# EAGLE design icE1usb-proto (EAGLE 7.5.0)

## Sheet 1 of 2: E1 Line interface
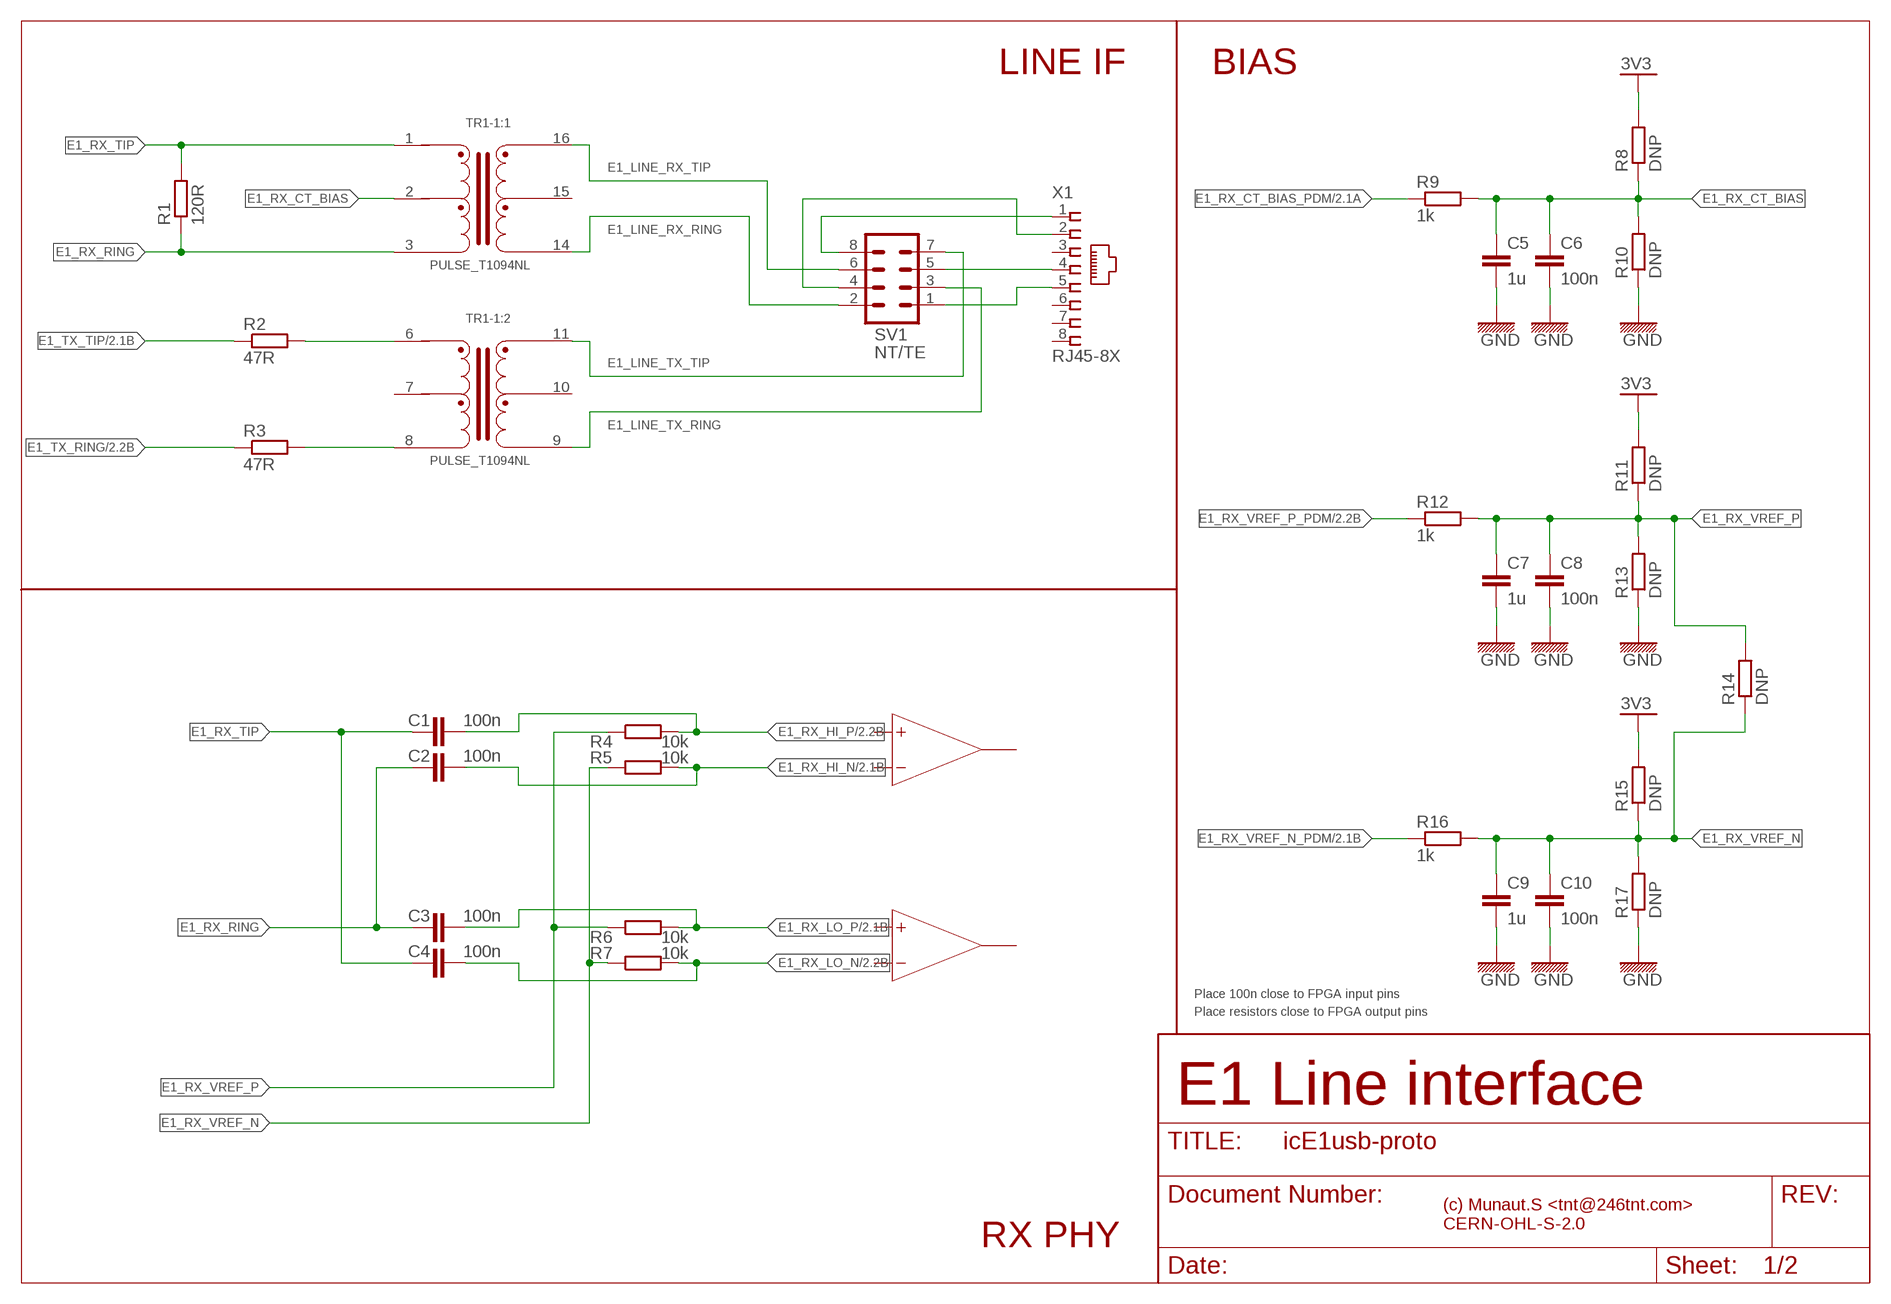
[diagram p0: schematic, sheet 1]

### Parts
C1  100n  C-EU_0603  [0603]
C2  100n  C-EU_0603  [0603]
C3  100n  C-EU_0603  [0603]
C4  100n  C-EU_0603  [0603]
C5  1u  C-EU_0603  [0603]
C6  100n  C-EU_0603  [0603]
C7  1u  C-EU_0603  [0603]
C8  100n  C-EU_0603  [0603]
C9  1u  C-EU_0603  [0603]
C10  100n  C-EU_0603  [0603]
R1  120R  R-EU_0603_A  [0603_A]
R2  47R  R-EU_0603_A  [0603_A]
R3  47R  R-EU_0603_A  [0603_A]
R4  10k  R-EU_0603_A  [0603_A]
R5  10k  R-EU_0603_A  [0603_A]
R6  10k  R-EU_0603_A  [0603_A]
R7  10k  R-EU_0603_A  [0603_A]
R8  DNP  R-EU_0603_A  [0603_A]
R9  1k  R-EU_0603_A  [0603_A]
R10  DNP  R-EU_0603_A  [0603_A]
R11  DNP  R-EU_0603_A  [0603_A]
R12  1k  R-EU_0603_A  [0603_A]
R13  DNP  R-EU_0603_A  [0603_A]
R14  DNP  R-EU_0603_A  [0603_A]
R15  DNP  R-EU_0603_A  [0603_A]
R16  1k  R-EU_0603_A  [0603_A]
R17  DNP  R-EU_0603_A  [0603_A]
SV1  NT/TE  MA04-2  [MA04-2]
TR1  PULSE_T1094NL  [PULSE_BH]
X1  RJ45-8X  [RJ45-NO-SHIELD]

### Nets
3V3: R8.2 R11.2 R15.2 ; also sheet 2
E1_LINE_P1: SV1.8 X1.1
E1_LINE_P2: SV1.4 X1.2
E1_LINE_P4: SV1.5 X1.4
E1_LINE_P5: SV1.1 X1.5
E1_LINE_RX_RING: SV1.2 TR1.14
E1_LINE_RX_TIP: SV1.6 TR1.16
E1_LINE_TX_RING: SV1.3 TR1.9
E1_LINE_TX_TIP: SV1.7 TR1.11
E1_RX_CT_BIAS: C5.1 C6.1 R8.1 R9.2 R10.2 TR1.2
E1_RX_CT_BIAS_PDM: R9.1 ; also sheet 2
E1_RX_HI_N: C2.2 R5.2 ; also sheet 2
E1_RX_HI_P: C1.2 R4.2 ; also sheet 2
E1_RX_LO_N: C4.2 R7.2 ; also sheet 2
E1_RX_LO_P: C3.2 R6.2 ; also sheet 2
E1_RX_RING: C2.1 C3.1 R1.1 TR1.3
E1_RX_TIP: C1.1 C4.1 R1.2 TR1.1
E1_RX_VREF_N: C9.1 C10.1 R5.1 R7.1 R14.1 R15.1 R16.2 R17.2
E1_RX_VREF_N_PDM: R16.1 ; also sheet 2
E1_RX_VREF_P: C7.1 C8.1 R4.1 R6.1 R11.1 R12.2 R13.2 R14.2
E1_RX_VREF_P_PDM: R12.1 ; also sheet 2
E1_TX_RING: R3.1 ; also sheet 2
E1_TX_TIP: R2.1 ; also sheet 2
GND: C5.2 C6.2 C7.2 C8.2 C9.2 C10.2 R10.1 R13.1 R17.1 ; also sheet 2
N$2: R2.2 TR1.6
N$3: R3.2 TR1.8
Unconnected: TR1.7 TR1.10 TR1.15 X1.3 X1.6 X1.7 X1.8

### Notes on the sheet
- LINE IF | BIAS
- Place 100n close to FPGA input pins
- Place resistors close to FPGA output pins
- E1 Line interface
- (c) Munaut.S <tnt@246tnt.com>
  CERN-OHL-S-2.0
- RX PHY

## Sheet 2 of 2: PMOD, USB & Clock
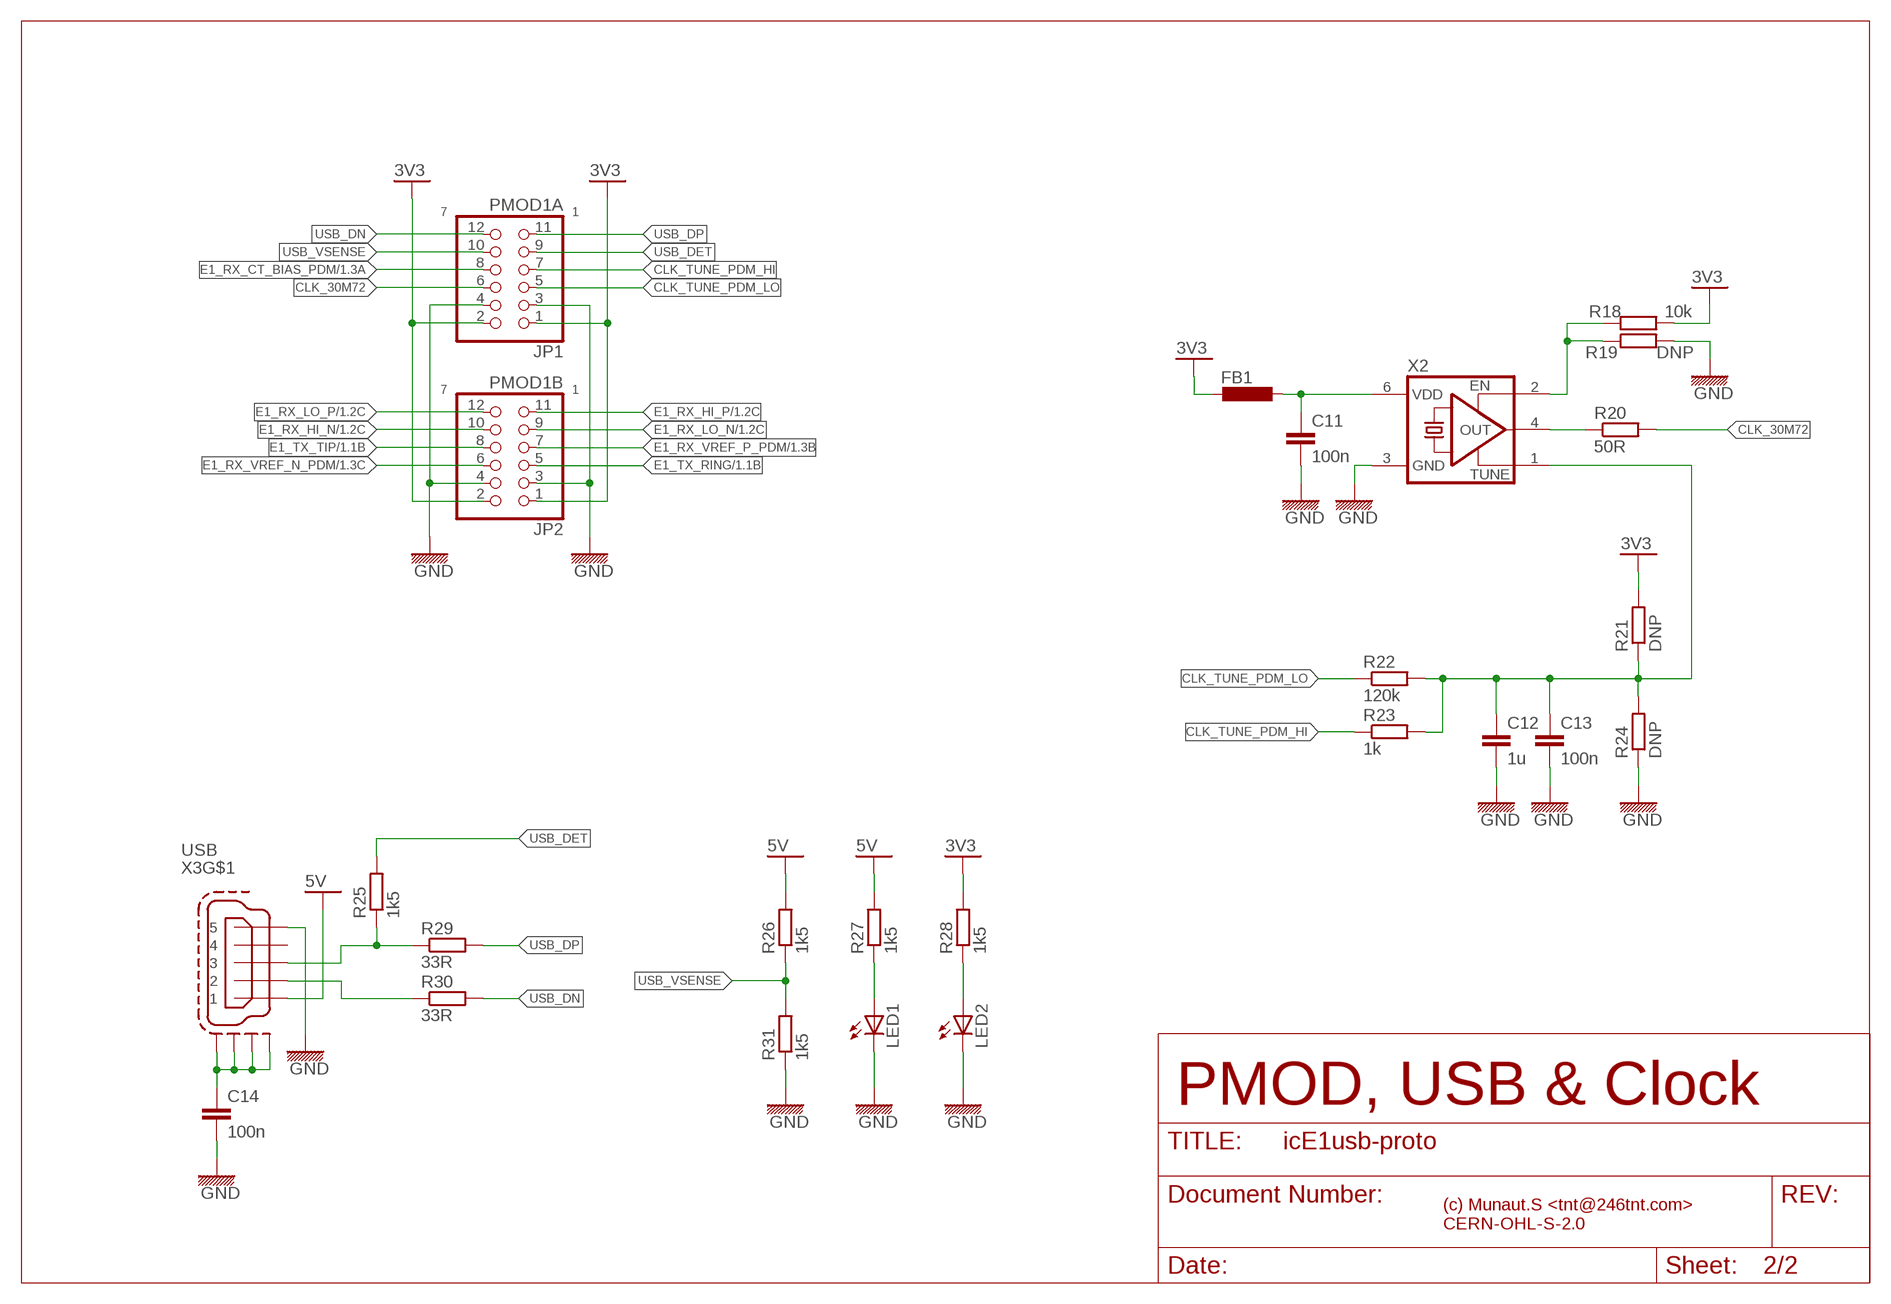
[diagram p1: schematic, sheet 2]

### Parts
C11  100n  C-EU_0603  [0603]
C12  1u  C-EU_0603  [0603]
C13  100n  C-EU_0603  [0603]
C14  100n  C-EU_0603  [0603]
FB1  FBEAD_0603  [0603]
JP1  PMOD1A  PINHD-2X6/90  [2X06/90]
JP2  PMOD1B  PINHD-2X6/90  [2X06/90]
LED1  LEDCHIPLED_0603  [CHIPLED_0603]
LED2  LEDCHIPLED_0603  [CHIPLED_0603]
R18  10k  R-EU_0603_A  [0603_A]
R19  DNP  R-EU_0603_A  [0603_A]
R20  50R  R-EU_0603_A  [0603_A]
R21  DNP  R-EU_0603_A  [0603_A]
R22  120k  R-EU_0603_A  [0603_A]
R23  1k  R-EU_0603_A  [0603_A]
R24  DNP  R-EU_0603_A  [0603_A]
R25  1k5  R-EU_0603_A  [0603_A]
R26  1k5  R-EU_0603_A  [0603_A]
R27  1k5  R-EU_0603_A  [0603_A]
R28  1k5  R-EU_0603_A  [0603_A]
R29  33R  R-EU_0603_A  [0603_A]
R30  33R  R-EU_0603_A  [0603_A]
R31  1k5  R-EU_0603_A  [0603_A]
X2  XTAL_OSC_ET_CFPV-45/46  [CFPV-45/46]
X3  USB  MINI-USB-SCHIELD-32005-201  [32005-201]

### Nets
3V3: FB1.1 JP1.1 JP1.2 JP2.1 JP2.2 R18.2 R21.2 R28.2 ; also sheet 1
5V: R26.2 R27.2 X3.1
CLK_30M72: JP1.6 R20.2
CLK_30M72_RAW: R20.1 X2.4(OUT)
CLK_TUNE: C12.1 C13.1 R21.1 R22.2 R23.2 R24.2 X2.1(TUNE)
CLK_TUNE_PDM_HI: JP1.7 R23.1
CLK_TUNE_PDM_LO: JP1.5 R22.1
E1_RX_CT_BIAS_PDM: JP1.8 ; also sheet 1
E1_RX_HI_N: JP2.10 ; also sheet 1
E1_RX_HI_P: JP2.11 ; also sheet 1
E1_RX_LO_N: JP2.9 ; also sheet 1
E1_RX_LO_P: JP2.12 ; also sheet 1
E1_RX_VREF_N_PDM: JP2.6 ; also sheet 1
E1_RX_VREF_P_PDM: JP2.7 ; also sheet 1
E1_TX_RING: JP2.5 ; also sheet 1
E1_TX_TIP: JP2.8 ; also sheet 1
GND: C11.2 C12.2 C13.2 C14.2 JP1.3 JP1.4 JP2.3 JP2.4 LED1.C LED2.C R19.2 R24.1 R31.1 X2.3(GND) X3.5 ; also sheet 1
N$1: C11.1 FB1.2 X2.6(VDD)
N$4: R18.1 R19.1 X2.2(EN)
N$7: C14.1 X3.M1(S:S1) X3.M2(S:S2) X3.M3(S:S3) X3.M4(S:S4)
N$13: LED1.A R27.1
N$14: LED2.A R28.1
USB_DET: JP1.9 R25.2
USB_DN: JP1.12 R30.2
USB_DN_PIN: R30.1 X3.2
USB_DP: JP1.11 R29.2
USB_DP_PIN: R25.1 R29.1 X3.3
USB_VSENSE: JP1.10 R26.1 R31.2
Unconnected: X3.4

### Notes on the sheet
- 7 | 1
- 7 | 1
- PMOD, USB & Clock
- (c) Munaut.S <tnt@246tnt.com>
  CERN-OHL-S-2.0

## Library data of the parts
C1-C14 = we_passive:C-EU: Capacitor
FB1 = we_passive:FBEAD: INDUCTOR SMD Bead inductor
JP1 JP2 = pinhead:PINHD-2X6: PIN HEADER
LED1 LED2 = led:LED: LED OSRAM: - CHIPLED LG R971, LG N971, LY N971, LG Q971, LY Q971, LO R971, LY R971 LH N974, LH R974 LS Q976, LO Q976, LY Q976 LO Q996 - Hyper CHIPLED LW Q18S LB Q993, LB Q99A, LB R99A - SideLED LS A670, LO A670, LY A670, LG A670, LP A670 LB A673, LV A673, LT A673, LW A673 LH A674 LY A675 LS A676, LA A676, LO A676, LY A676, LW A676 LS A679, LY A679, LG A679 - Hyper Micro SIDELED® LS Y876, LA Y876, LO Y876, LY Y876 LT Y87S - SmartLED LW L88C, LW L88S LB L89C, LB L89S, LG L890 LS L89K, LO L89K, LY L89K LS L896, LA L896, LO L896, LY L896 - TOPLED LS T670, LO T670, LY T670, LG T670, LP T670 LSG T670, LSP T670, LSY T670, LOP T670, LYG T670 LG T671, LOG T671, LSG T671 LB T673, LV T673, LT T673, LW T673 LH T674 LS T676, LA T676, LO T676, LY T676, LB T676, LH T676, LSB T676, LW T676 LB T67C, LV T67C, LT T67C, LS T67K, LO T67K, LY T67K, LW E67C LS E67B, LA E67B, LO E67B, LY E67B, LB E67C, LV E67C, LT E67C LW T67C LS T679, LY T679, LG T679 LS T770, LO T770, LY T770, LG T770, LP T770 LB T773, LV T773, LT T773, LW T773 LH T774 LS E675, LA E675, LY E675, LS T675 LS T776, LA T776, LO T776, LY T776, LB T776 LHGB T686 LT T68C, LB T68C - Hyper Mini TOPLED® LB M676 - Mini TOPLED Santana® LG M470 LS M47K, LO M47K, LY M47K Source: http://www.osram.convergy.de LUXEON: - LUMILED® LXK2-PW12-R00, LXK2-PW12-S00, LXK2-PW14-U00, LXK2-PW14-V00 LXK2-PM12-R00, LXK2-PM12-S00, LXK2-PM14-U00 LXK2-PE12-Q00, LXK2-PE12-R00, LXK2-PE12-S00, LXK2-PE14-T00, LXK2-PE14-U00 LXK2-PB12-K00, LXK2-PB12-L00, LXK2-PB12-M00, LXK2-PB14-N00, LXK2-PB14-P00, LXK2-PB14-Q00 LXK2-PR12-L00, LXK2-PR12-M00, LXK2-PR14-Q00, LXK2-PR14-R00 LXK2-PD12-Q00, LXK2-PD12-R00, LXK2-PD12-S00 LXK2-PH12-R00, LXK2-PH12-S00 LXK2-PL12-P00, LXK2-PL12-Q00, LXK2-PL12-R00 Source: www.luxeon.com KINGBRIGHT: KA-3528ASYC Source: www.kingbright.com
R1-R31 = we_passive:R-EU: Resistor
SV1 = con-lstb:MA04-2: PIN HEADER; OC_FARNELL: unknown; OC_NEWARK: unknown
TR1 = we_passive:PULSE_T1094NL
X1 = con-tycoelectronics:RJ45: CORCOM Modular RJ Jacks No Shield Source: www.tycoelectronics.com .. ENG_DS_1654001_1099_RJ_L_0507.pdf; MPN: RJ45-8X; OC_FARNELL: unknown; OC_NEWARK: 16R6101
X2 = we_passive:XTAL_OSC_ET: Crystal Oscillator with Enable (E) & Tune (T)
X3 = con-cypressindustries:MINI-USB-SCHIELD-: MINI USB-B Conector Source: www.cypressindustries.com; OC_FARNELL: unknown; OC_NEWARK: unknown

## Board
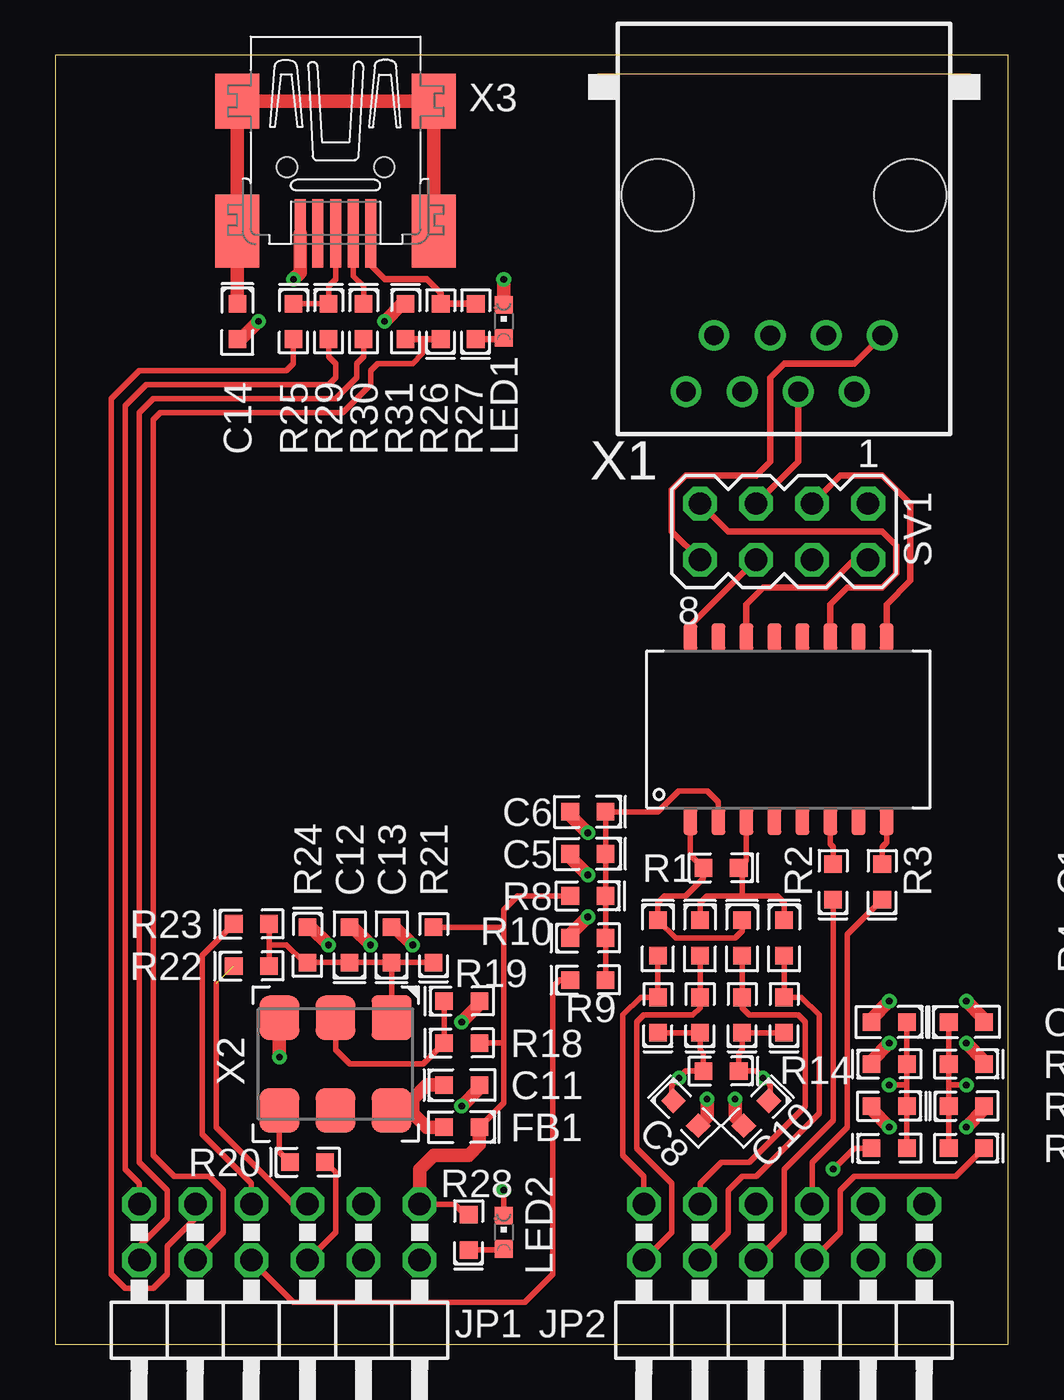
[diagram p2: board, top side]
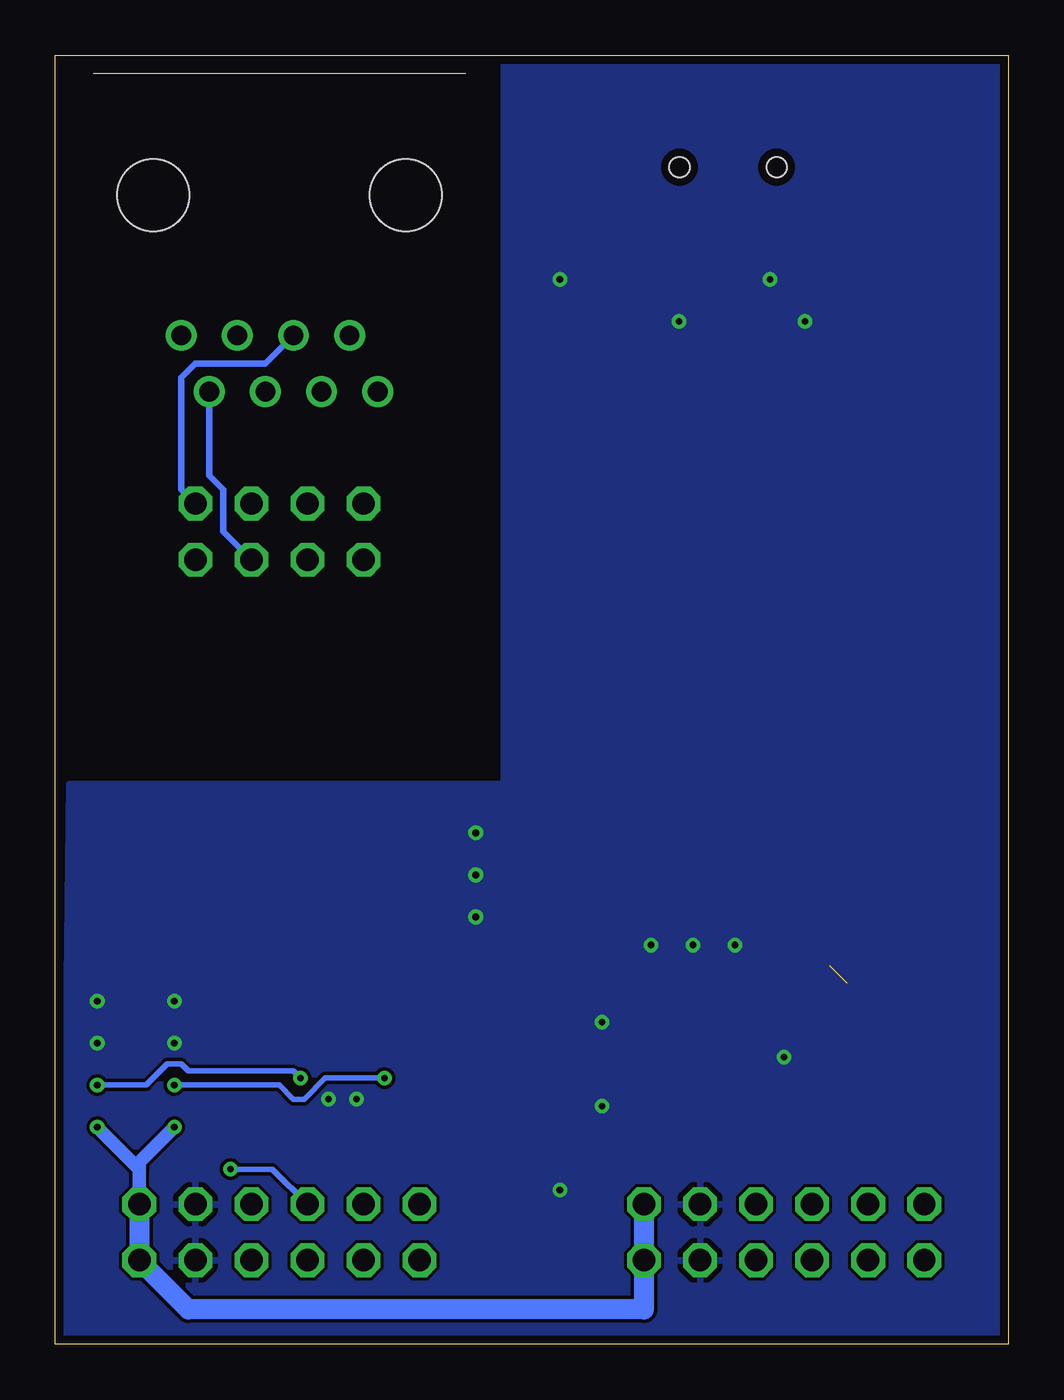
[diagram p3: board, bottom side, seen from below]

Size 43.18 x 58.42 mm. Coordinates in mm from the lower left corner, seen from the top.
Outline: 0,0 43.18,0 43.18,58.42 0,58.42 0,0
Copper layers (1*16): Top 0.0356mm / dielectric 1.5011mm / Bottom 0.0356mm
Design rules "LaenPCBOrder *": minimum track width 6mil, minimum drill 12mil, track to track 6mil, track to pad 6mil, pad to pad 6mil, via to via 6mil, smd to smd 6mil, copper to edge 15mil, drill to drill 6mil, minimum pad ring 7mil, minimum via ring 7mil, stop-mask expansion 4mil, vias tented up to drill 15mil, thermal gap 10mil

### Footprints (pad centres in the part's own frame; a part is rotated, then mirrored left to right if it is on the bottom)
0603 = smd 0.8 x 0.8: 1 -0.8,0; 2 0.8,0
2X06/90 = drill 1.016 octagon: 1 -6.35,-6.35; 2 -6.35,-3.81; 3 -3.81,-6.35; 4 -3.81,-3.81; 5 -1.27,-6.35; 6 -1.27,-3.81; 7 1.27,-6.35; 8 1.27,-3.81; 9 3.81,-6.35; 10 3.81,-3.81; 11 6.35,-6.35; 12 6.35,-3.81
CHIPLED_0603 = smd 0.8 x 0.8: A 0,-0.75; C 0,0.75
0603_A = smd 0.8 x 0.8: 1 -0.8,0; 2 0.8,0
MA04-2 = drill 1.016 octagon: 1 -3.81,-1.27; 2 -3.81,1.27; 3 -1.27,-1.27; 4 -1.27,1.27; 5 1.27,-1.27; 6 1.27,1.27; 7 3.81,-1.27; 8 3.81,1.27
PULSE_BH = smd 1.27 x 0.635: 1 -4.23,4.25; 2 -4.23,2.98; 3 -4.23,1.71; 4 -4.23,0.44; 5 -4.23,-0.83; 6 -4.23,-2.1; 7 -4.23,-3.37; 8 -4.23,-4.64; 9 4.1,-4.64; 10 4.1,-3.37; 11 4.1,-2.1; 12 4.1,-0.83; 13 4.1,0.44; 14 4.1,1.71; 15 4.1,2.98; 16 4.1,4.25
RJ45-NO-SHIELD = drill 0.9 pad 1.4: 1 -4.445,6.35; 2 -3.175,8.89; 3 -1.905,6.35; 4 -0.635,8.89; 5 0.635,6.35; 6 1.905,8.89; 7 3.175,6.35; 8 4.445,8.89 | hole 3.251: -5.715,0; 5.715,0
CFPV-45/46 = smd 1.8 x 2: 1 -2.54,-2.1; 2 0,-2.1; 3 2.54,-2.1; 4 2.54,2.1; 5 0,2.1; 6 -2.54,2.1
32005-201 = smd 3.1 x 0.5: 1 3,1.6; 2 3,0.8; 3 3,0; 4 3,-0.8; 5 3,-1.6 | smd 2.5 x 2: M1 -3,-4.45; M2 -3,4.45 | smd 3.3 x 2: M3 2.9,4.45; M4 2.9,-4.45 | hole 0.9: 0,2.2; 0,-2.2

### Placement (x,y rotation side)
C1  27.3,18.41 270 top
C2  33.02,18.41 270 top
C3  29.21,18.41 270 top
C4  31.11,18.41 270 top
C5  24.13,22.23 180 top
C6  24.13,24.13 180 top
C7  37.78,14.61 180 top
C8  28.57,10.48 315 top
C9  41.27,14.61 0 top
C10  31.75,10.48 225 top
C11  18.41,11.75 0 top
C12  13.34,18.1 90 top
C13  15.24,18.1 90 top
C14  8.26,46.35 270 top
FB1  18.41,9.84 180 top
JP1  10.16,0 180 top
JP2  33.02,0 180 top
LED1  20.32,46.35 0 top
LED2  20.32,5.08 0 top
R1  30.16,21.59 180 top
R2  35.24,20.95 90 top
R3  37.47,20.95 90 top
R4  27.3,14.92 90 top
R5  33.02,14.92 90 top
R6  29.21,14.92 90 top
R7  31.11,14.92 90 top
R8  24.13,20.32 180 top
R9  24.13,16.51 0 top
R10  24.13,18.41 0 top
R11  37.78,10.79 180 top
R12  37.78,8.89 0 top
R13  37.78,12.7 0 top
R14  30.16,12.38 180 top
R15  41.27,10.79 0 top
R16  41.27,8.89 180 top
R17  41.27,12.7 180 top
R18  18.41,13.65 0 top
R19  18.41,15.56 0 top
R20  11.43,8.26 0 top
R21  17.14,18.1 90 top
R22  8.89,17.14 0 top
R23  8.89,19.05 0 top
R24  11.43,18.1 270 top
R25  10.79,46.35 270 top
R26  17.46,46.35 90 top
R27  19.05,46.35 90 top
R28  18.73,5.08 90 top
R29  12.38,46.35 270 top
R30  13.97,46.35 270 top
R31  15.88,46.35 270 top
SV1  33.02,36.83 180 top
TR1  33.02,27.94 90 top
X1  33.02,52.07 180 top
X2  12.7,12.7 180 top
X3  12.7,53.34 270 top

### Tracks (layer width: path | path; a pad name or v marks a point on that pad's centre or on a via)
3V3  (via drill 0.3)
  Top 0.254: R8.2 20.95,20.32 20.32,19.68 20.32,18.9 | R28.2 18.57,5.88 18.1,6.35 JP1.1 | R18.2 20.32,13.65 | 20.32,13.65 20.32,10.95 FB1.1 | R21.2 20.32,18.9 | 20.32,13.65 20.32,18.73 20.32,18.9
  Top 0.61: R11.2 36.98,10.64 v37.78,9.84 | R15.2 42.08,10.64 v41.27,9.84 | FB1.1 19.21,9.05 18.73,8.57 17.14,8.57 16.51,7.94 JP1.1
  Bottom 0.61: JP2.1 39.37,7.94 | 39.37,7.94 39.37,8.26 v37.78,9.84 | v41.27,9.84 39.37,7.94
  Bottom 0.914: JP2.1 JP2.2 37.15,1.59 16.51,1.59 JP1.2 JP1.1
5V
  Top 0.305: X3.1 14.29,50.33 14.29,48.9 14.92,48.26 16.83,48.26 17.46,47.62 R26.2 R27.2
CLK_30M72
  Top 0.254: JP1.6 12.7,5.08 12.7,7.79 R20.2
CLK_30M72_RAW
  Top 0.254: X2.4 10.16,8.72 R20.1
CLK_TUNE
  Top 0.254: R22.2 9.69,18.1 | 9.69,18.1 R23.2 | 9.69,18.1 10.48,18.1 11.28,17.3 R24.2 C12.1 C13.1 | C13.1 R21.1 | C13.1 X2.1
CLK_TUNE_PDM_HI
  Top 0.254: JP1.7 8.89,7.3 6.67,9.53 6.67,17.63 R23.1
CLK_TUNE_PDM_LO  (1 unrouted)
  Top 0.254: JP1.5 10.79,6.35 7.3,9.84 7.3,16.36
E1_LINE_P1
  Top 0.305: X1.1 36.2,44.45 33.02,44.45 32.38,43.81 32.38,40.01 31.75,39.37 28.57,39.37 27.94,38.73 27.94,36.83 SV1.8
E1_LINE_P2
  Bottom 0.305: SV1.4 35.56,36.83 35.56,38.73 36.2,39.37 X1.2
E1_LINE_P4
  Top 0.305: X1.4 33.66,40.01 SV1.5
E1_LINE_P5
  Bottom 0.305: X1.5 33.66,44.45 36.83,44.45 37.47,43.81 37.47,38.73 SV1.1
E1_LINE_RX_RING
  Top 0.305: SV1.2 36.2,35.56 34.92,34.29 32.07,34.29 31.31,33.53 TR1.14
E1_LINE_RX_TIP
  Top 0.305: TR1.16 28.77,32.58 SV1.6
E1_LINE_TX_RING
  Top 0.305: SV1.3 35.56,39.37 37.47,39.37 38.73,38.1 38.73,34.61 37.66,33.53 TR1.9
E1_LINE_TX_TIP
  Top 0.305: SV1.7 30.48,36.83 37.47,36.83 38.1,36.2 38.1,34.92 37.47,34.29 35.88,34.29 35.12,33.53 TR1.11
E1_RX_CT_BIAS
  Top 0.254: TR1.2 30.04,24.57 29.53,25.08 28.26,25.08 27.3,24.13 C6.1 C5.1 R8.1 R10.2 R9.2
E1_RX_CT_BIAS_PDM
  Top 0.254: JP1.8 10.79,1.91 21.27,1.91 22.54,3.17 22.54,16.19 22.86,16.51 R9.1
E1_RX_HI_N
  Top 0.254: C2.2 R5.2 33.81,15.72 34.61,14.92 34.61,10.48 31.75,7.62 31.11,7.62 30.48,6.99 30.48,5.08 JP2.10
E1_RX_HI_P
  Top 0.254: C1.2 R4.2 26.52,15.72 25.72,14.92 25.72,8.57 26.67,7.62 JP2.11
E1_RX_LO_N
  Top 0.254: C4.2 R7.2 31.11,15.24 31.43,14.92 33.66,14.92 33.97,14.61 33.97,10.79 31.43,8.26 30.16,8.26 29.21,7.3 JP2.9
E1_RX_LO_P
  Top 0.254: C3.2 R6.2 29.21,15.24 28.89,14.92 26.67,14.92 26.35,14.61 26.35,8.89 27.94,7.3 27.94,5.08 JP2.12
E1_RX_RING
  Top 0.254: TR1.3 31.31,21.94 R1.1 arc-90 31.11,21.44 31.11,20.32 | C2.1 33.02,20 32.7,20.32 31.11,20.32 | 31.11,20.32 29.53,20.32 29.21,20 C3.1
E1_RX_TIP
  Top 0.254: TR1.1 28.77,22.18 R1.2 29.36,21.11 28.57,20.32 27.62,20.32 27.3,20 C1.1 28.11,18.41 30.8,18.41 31.11,18.73 C4.1
E1_RX_VREF_N  (via drill 0.3)
  Top 0.254: R5.1 R7.1 31.11,13.34 30.96,13.18 R14.1 31.75,12.38 v32.07,12.06 32.38,11.75 32.38,11.11 C10.1 | C9.1 R17.2 40.48,11.75 | 40.48,11.75 R15.1 R16.2 | v41.27,11.75 40.48,11.75
  Bottom 0.254: v32.07,12.06 32.38,12.38 37.15,12.38 37.47,12.7 38.1,12.7 39.05,11.75 v41.27,11.75
E1_RX_VREF_N_PDM
  Top 0.254: JP2.6 35.56,5.08 35.56,6.99 36.2,7.62 40.8,7.62 R16.1
E1_RX_VREF_P  (via drill 0.3)
  Top 0.254: R4.1 R6.1 29.21,13.34 29.36,13.18 R14.2 28.57,12.38 v28.26,12.06 27.94,11.75 27.94,11.43 C8.1 | R12.2 R11.1 38.58,11.75 | 38.58,11.75 R13.2 C7.1 | v37.78,11.75 38.58,11.75
  Bottom 0.254: v37.78,11.75 33.02,11.75 32.38,11.11 31.91,11.11 30.96,12.06 v28.26,12.06
E1_RX_VREF_P_PDM  (via drill 0.3)
  Top 0.254: R12.1 36.2,8.89 v35.24,7.94
  Bottom 0.254: JP2.7 33.34,7.94 v35.24,7.94
E1_TX_RING
  Top 0.254: JP2.5 34.29,8.26 35.88,9.84 35.88,18.57 R3.1
E1_TX_TIP
  Top 0.254: JP2.8 33.02,5.08 33.02,7.94 35.24,10.16 R2.1
GND  (via drill 0.3)
  Top 0.254: LED2.C v20.32,6.99
  Top 0.61: R17.1 42.08,12.85 v41.27,13.65 | C9.2 42.08,14.76 v41.27,15.56 | C7.2 36.98,14.76 v37.78,15.56 | R13.1 36.98,12.85 v37.78,13.65 | C8.2 29.53,10.3 v29.53,11.11 | C10.2 30.8,10.3 v30.8,11.11 | C6.2 23.33,23.98 v24.13,23.18 | C5.2 23.33,22.07 v24.13,21.27 | R10.1 23.33,18.57 v24.13,19.37 | X3.5 11.1,48.56 v10.79,48.26 | LED1.C v20.32,48.26 | R31.1 15.72,47.16 v14.92,46.35 | C14.2 8.41,45.55 v9.21,46.35 | C11.2 19.21,11.6 v18.41,10.79 | R19.2 19.21,15.4 v18.41,14.61 | X2.3 v10.16,13.02 | R24.1 11.58,18.9 v12.38,18.1 | C12.2 13.49,18.9 v14.29,18.1 | C13.2 15.39,18.9 v16.19,18.1
  pour Bottom: 0.32,0.32 42.86,0.32 42.55,25.4 22.86,25.4 22.86,58.1 0.32,58.1
N$1
  Top 0.61: FB1.2 16.83,9.84 16.19,10.48 | 16.19,10.48 15.36,10.48 X2.6 | C11.1 16.83,11.75 16.19,11.11 16.19,10.48
N$2
  Top 0.254: TR1.6 35.12,22.66 35.24,22.54 R2.2
N$3
  Top 0.254: TR1.8 37.66,22.74 37.47,22.54 R3.2
N$4
  Top 0.254: X2.2 12.7,13.34 13.34,12.7 16.66,12.7 R18.1 R19.1
N$7
  Top 0.61: X3.M3 X3.M2 X3.M1 X3.M4 C14.1
N$13
  Top 0.305: R27.1 20.27,45.55 LED1.A
N$14
  Top 0.254: R28.1 20.27,4.28 LED2.A
USB_DET
  Top 0.254: R25.2 10.79,44.45 10.48,44.13 3.81,44.13 2.54,42.86 2.54,3.17 3.17,2.54 4.45,2.54 5.08,3.17 5.08,4.45 6.35,5.71 JP1.9
USB_DN
  Top 0.254: R30.2 13.97,44.77 13.65,44.45 13.65,43.81 12.7,42.86 4.45,42.86 3.81,42.23 3.81,8.26 5.08,6.99 5.08,5.71 3.81,4.45 JP1.12
USB_DN_PIN
  Top 0.254: X3.2 13.5,48.41 13.97,47.94 R30.1
USB_DP
  Top 0.254: R29.2 12.38,44.77 12.7,44.45 12.7,43.81 12.38,43.5 4.13,43.5 3.17,42.55 3.17,7.94 3.81,7.3 JP1.11
USB_DP_PIN
  Top 0.254: X3.3 12.7,48.26 12.38,47.94 R29.1 R25.1
USB_VSENSE
  Top 0.254: 16.64,45.55 16.64,44.89 16.19,44.45 14.61,44.45 14.29,44.13 14.29,43.5 13.02,42.23 4.76,42.23 4.45,41.91 4.45,8.57 5.4,7.62 6.99,7.62 7.62,6.99 7.62,5.08 JP1.10
  Top 0.305: R26.1 16.64,45.55 R31.2